# EAGLE design Dual linear VCA chip (EAGLE 6.4)
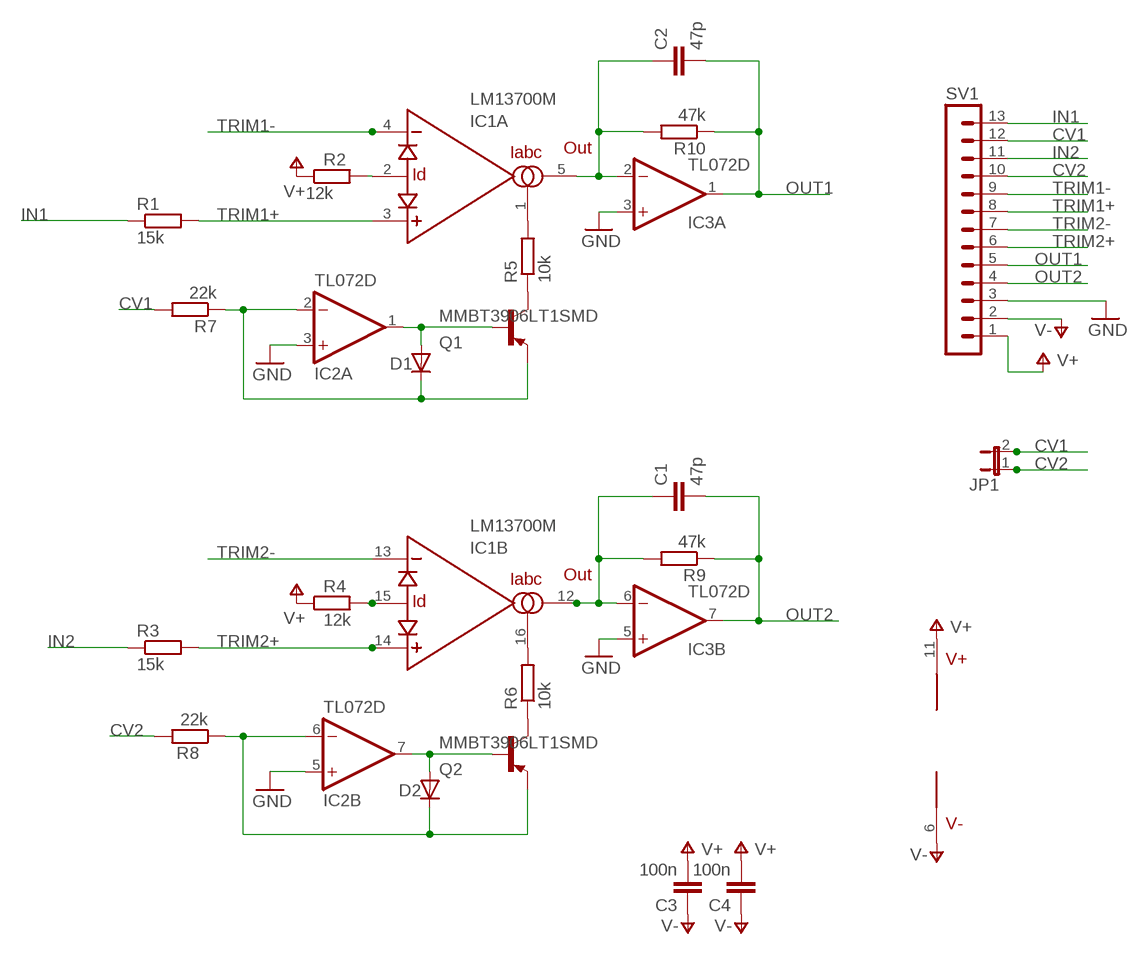
[diagram p0: schematic, sheet 1]

## Parts
C1  47p  C-EUC0805  [C0805]
C2  47p  C-EUC0805  [C0805]
C3  100n  C-EUC0805  [C0805]
C4  100n  C-EUC0805  [C0805]
D1  DIODE-SOD80C  [SOD80C]
D2  DIODE-SOD80C  [SOD80C]
IC1  LM13700M  [SO16]
IC2  TL072D  [SO08]
IC3  TL072D  [SO08]
JP1  JP1E  [JP1]
Q1  MMBT3906LT1SMD  [SOT23-BEC]
Q2  MMBT3906LT1SMD  [SOT23-BEC]
R1  15k  R-EU_R0805  [R0805]
R2  12k  R-EU_R0805  [R0805]
R3  15k  R-EU_R0805  [R0805]
R4  12k  R-EU_R0805  [R0805]
R5  10k  R-EU_R0805  [R0805]
R6  10k  R-EU_R0805  [R0805]
R7  22k  R-EU_R0805  [R0805]
R8  22k  R-EU_R0805  [R0805]
R9  47k  R-EU_R0805  [R0805]
R10  47k  R-EU_R0805  [R0805]
SV1  MA13-1  [MA13-1]

## Nets
CV1: JP1.2 R7.2 SV1.12
CV2: JP1.1 R8.2 SV1.10
GND: IC2.3(A:+IN) IC2.5(B:+IN) IC3.3(A:+IN) IC3.5(B:+IN) SV1.3
IN1: R1.1 SV1.13
IN2: R3.1 SV1.11
N$1: Q1.C R5.1
N$2: Q2.C R6.1
N$3: D1.C IC2.2(A:-IN) Q1.E R7.1
N$4: IC1.1(A:IABC) R5.2
N$6: IC1.2(A:ID) R2.2
N$8: D2.A IC2.7(B:OUT) Q2.B
N$9: C2.1 IC1.5(A:OUT) IC3.2(A:-IN) R10.2
N$10: D1.A IC2.1(A:OUT) Q1.B
N$11: D2.C IC2.6(B:-IN) Q2.E R8.1
N$14: IC1.16(B:IABC) R6.2
N$17: IC1.15(B:ID) R4.2
N$21: C1.1 IC1.12(B:OUT) IC3.6(B:-IN) R9.2
OUT1: C2.2 IC3.1(A:OUT) R10.1 SV1.4
OUT2: C1.2 IC3.7(B:OUT) R9.1 SV1.5
TRIM1+: IC1.3(A:+IN) R1.2 SV1.8
TRIM1-: IC1.4(A:-IN) SV1.9
TRIM2+: IC1.14(B:+IN) R3.2 SV1.6
TRIM2-: IC1.13(B:-IN) SV1.7
V+: C3.2 C4.2 IC1.11(V+) R2.1 R4.1 SV1.1
V-: C3.1 C4.1 IC1.6(V-) SV1.2
Unconnected: IC1.7(IN) IC1.8(OUT) IC1.9(OUT) IC1.10(IN)

## Power pins joined to a net without a drawn wire
V+: IC2.8(P:V+) IC3.8(P:V+)
V-: IC2.4(P:V-) IC3.4(P:V-)

## Library data of the parts
C1-C4 = resistor:C-EU: CAPACITOR, European symbol
D1 D2 = diode:DIODE-: DIODE
IC1 = synthdiy:LM13700: National Dual OTA with buffers.
IC2 IC3 = linear:TL072: OP AMP
JP1 = jumper:JP1E: JUMPER
Q1 Q2 = transistor-pnp:MMBT3906*: PNP Transistror
R1-R10 = resistor:R-EU_: RESISTOR, European symbol
SV1 = con-lstb:MA13-1: PIN HEADER; OC_FARNELL: unknown; OC_NEWARK: unknown

## Board
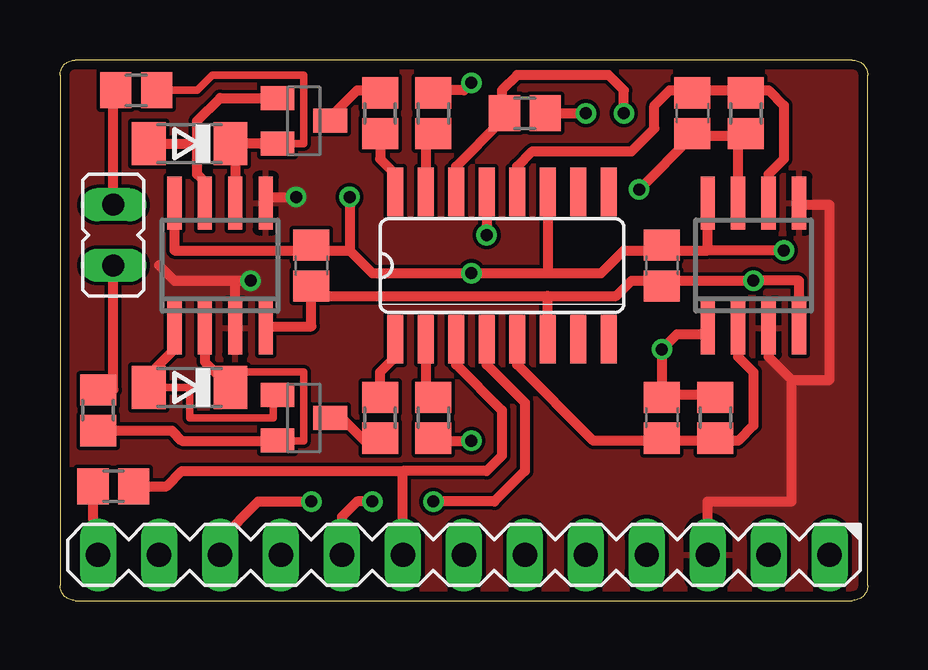
[diagram p1: board, top side]
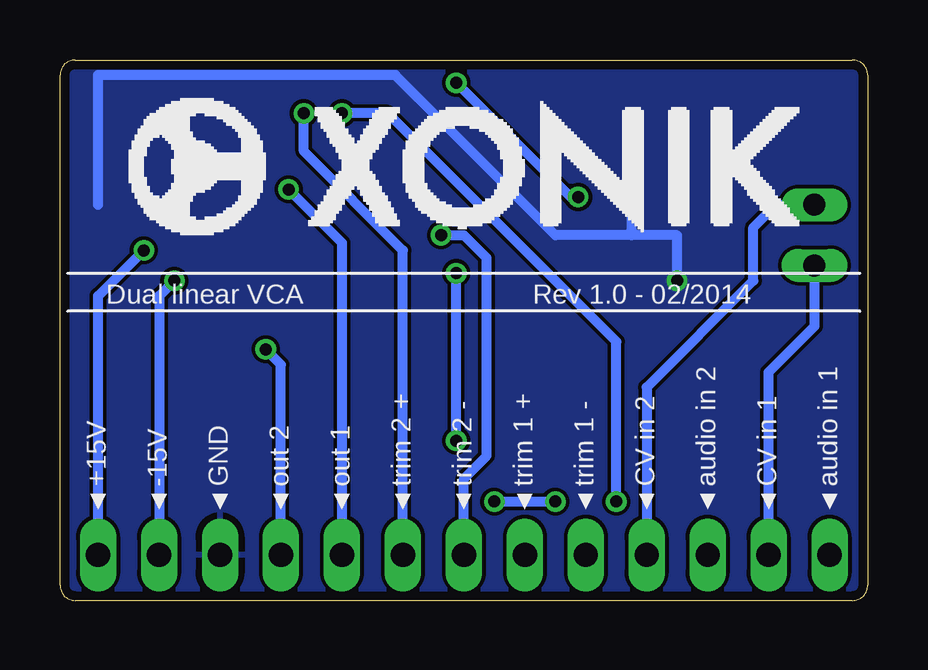
[diagram p2: board, bottom side, seen from below]

Size 33.66 x 22.54 mm. Coordinates in mm from the lower left corner, seen from the top.
Outline: 0.64,0 33.02,0 arc90 33.66,0.64 33.66,21.91 arc90 33.02,22.54 0.64,22.54 arc90 0,21.91 0,0.64 arc90 0.64,0
Copper layers (1*16): Top 0.0356mm / dielectric 1.5011mm / Bottom 0.0356mm
Design rules "LaenPCBOrder": minimum track width 6mil, minimum drill 13mil, track to track 6mil, track to pad 6mil, pad to pad 6mil, via to via 6mil, smd to smd 6mil, copper to edge 15mil, drill to drill 6mil, minimum pad ring 7mil, minimum via ring 7mil, stop-mask expansion 3mil, vias tented up to drill 0mil, thermal gap 10mil

### Footprints (pad centres in the part's own frame; a part is rotated, then mirrored left to right if it is on the bottom)
C0805 = smd 1.3 x 1.5: 1 -0.85,0; 2 0.85,0
SOD80C = smd 1.4 x 1.8: A 1.7,0; C -1.7,0
SO16 = smd 0.66 x 2.032: 1 -4.445,-3.073; 2 -3.175,-3.073; 3 -1.905,-3.073; 4 -0.635,-3.073; 5 0.635,-3.073; 6 1.905,-3.073; 7 3.175,-3.073; 8 4.445,-3.073; 9 4.445,3.073; 10 3.175,3.073; 11 1.905,3.073; 12 0.635,3.073; 13 -0.635,3.073; 14 -1.905,3.073; 15 -3.175,3.073; 16 -4.445,3.073
SO08 = smd 0.6 x 2.2: 1 -1.905,-2.6; 2 -0.635,-2.6; 3 0.635,-2.6; 4 1.905,-2.6; 5 1.905,2.6; 6 0.635,2.6; 7 -0.635,2.6; 8 -1.905,2.6
JP1 = drill 0.914 long: 1 0,-1.27; 2 0,1.27
SOT23-BEC = smd 1 x 1.4: B -0.95,-1.1; C 0,1.1; E 0.95,-1.1
R0805 = smd 1.3 x 1.5: 1 -0.85,0; 2 0.85,0
MA13-1 = drill 1.016 long: 1 -15.24,0; 2 -12.7,0; 3 -10.16,0; 4 -7.62,0; 5 -5.08,0; 6 -2.54,0; 7 0,0; 8 2.54,0; 9 5.08,0; 10 7.62,0; 11 10.16,0; 12 12.7,0; 13 15.24,0

### Placement (x,y rotation side)
C1  26.35,20.32 270 top
C2  25.08,7.62 90 top
C3  10.48,13.97 90 top
C4  25.08,13.97 90 top
D1  5.4,8.89 180 top
D2  5.4,19.05 180 top
IC1  18.41,13.97 0 top
IC2  6.67,13.97 0 top
IC3  28.89,13.97 0 top
JP1  2.22,15.24 180 top
Q1  10.16,7.62 270 top
Q2  10.16,20 270 top
R1  2.22,4.76 0 top
R2  15.56,7.62 90 top
R3  19.37,20.32 180 top
R4  15.56,20.32 270 top
R5  13.34,7.62 90 top
R6  13.34,20.32 270 top
R7  1.59,7.94 90 top
R8  3.17,21.27 180 top
R9  28.57,20.32 90 top
R10  27.3,7.62 270 top
SV1  16.83,1.91 180 top

### Tracks (layer width: path | path; a pad name or v marks a point on that pad's centre or on a via)
CV1
  Top 0.406: R7.2 2.22,8.79 JP1.2
  Bottom 0.406: SV1.12 4.13,9.53 2.22,11.43 JP1.2
CV2
  Top 0.406: 2.22,21.59 R8.2 2.22,21.17 JP1.1
  Bottom 0.406: SV1.10 9.21,8.89 4.76,13.34 4.76,15.56 3.81,16.51 JP1.1
GND  (via drill 0.5)
  Top 0.406: IC3.3 29.53,10.16 30.48,9.21 | 30.48,9.21 32.07,9.21 32.07,16.51 30.8,16.51 IC3.5 30.86,16.51 | 4.13,13.97 4.76,13.34 7.3,13.34 | SV1.3 26.99,4.13 30.48,4.13 30.48,9.21 | IC2.5 8.57,16.83 v9.84,16.83 | IC2.3 7.3,13.34 | 7.3,13.34 v7.94,13.34
  Bottom 0.406: v7.94,13.34 7.94,15.24 9.84,15.24 | 9.84,15.24 v9.84,16.83 | 32.07,16.51 32.07,21.91 19.68,21.91 13.02,15.24 9.84,15.24
  pour Top: 0,22.54 33.66,22.54 33.66,0 0,0
  pour Bottom: 0,22.54 33.66,22.54 33.66,0 0,0
IN1
  Top 0.406: R1.1 1.37,3.39 1.59,2.86 SV1.13
IN2  (via drill 0.5)
  Top 0.406: SV1.11 6.67,2.54 8.26,4.13 v10.48,4.13 | R3.1 v21.91,20.32
  Bottom 0.406: v10.48,4.13 10.48,10.79 20,20.32 v21.91,20.32
N$1
  Top 0.406: Q1.C 11.75,7.62 12.7,6.67 13.23,6.67 R5.1
N$2
  Top 0.406: Q2.C 11.26,20.15 12.38,21.27 13.23,21.27 R6.1
N$3
  Top 0.305: D1.C 7.42,9 7.62,9.21 7.62,9.53 10.16,9.53 10.16,6.67 Q1.E
  Top 0.406: IC2.2 6.03,9.96 D1.C | R7.1 4.66,7.09 5.08,6.67 Q1.E
N$4
  Top 0.406: R5.2 13.34,9.53 13.97,10.16 IC1.1
N$6
  Top 0.406: IC1.2 15.24,8.79 R2.2
N$8
  Top 0.406: IC2.7 6.03,17.46 5.71,17.78 5.71,19.05 | 5.71,19.05 5.71,20 6.67,20.95 Q2.B | D2.A 5.71,19.05
N$9
  Top 0.406: IC1.5 19.05,9.84 22.23,6.67 24.77,6.67 24.87,6.77 24.87,6.99 C2.1 25.18,6.67 27.3,6.67 R10.2 27.41,6.67 28.26,6.67 28.89,7.3 28.89,9.53 28.26,10.16 IC3.2
N$10
  Top 0.305: Q1.B 9.06,8.43 8.89,8.26 8.89,7.62 5.4,7.62 5.4,8.89 D1.A
  Top 0.406: D1.A 4.01,9.73 4.76,10.48 IC2.1
N$11
  Top 0.305: R8.1 5.71,21.27 6.35,21.91 10.16,21.91 10.16,19.05 Q2.E
  Top 0.406: IC2.6 7.3,18.3 D2.C 8.37,19.05 Q2.E
N$14
  Top 0.406: R6.2 13.34,18.41 13.97,17.78 IC1.16
N$17
  Top 0.406: R4.2 15.34,19.47 15.24,19.37 IC1.15
N$21
  Top 0.406: IC1.12 19.05,18.1 19.68,18.73 23.81,18.73 24.77,19.68 24.77,20.64 25.4,21.27 26.35,21.27 | 26.35,21.27 26.14,20.95 C1.1 26.35,21.27 | 26.35,21.27 28.47,21.27 R9.2 28.57,21.27 29.53,21.27 30.16,20.64 30.16,18.41 29.53,17.78 IC3.6
OUT1  (via drill 0.5)
  Top 0.406: IC3.1 26.73,11.11 25.72,11.11 v25.08,10.48 C2.2 25.18,8.57 27.3,8.57 R10.1
  Bottom 0.406: SV1.4 24.45,9.84 v25.08,10.48
OUT2  (via drill 0.5)
  Top 0.406: IC3.7 28.26,19.05 28.36,19.15 28.89,19.15 R9.1 28.79,19.47 28.89,19.37 26.45,19.37 C1.2 26.35,19.37 v24.13,17.14
  Bottom 0.406: v24.13,17.14 21.91,14.92 SV1.5
TRIM1+
  Top 0.406: IC1.3 16.51,9.84 18.41,7.94 18.41,6.03 17.78,5.4 14.29,5.4 | SV1.8 14.29,5.4 | R1.2 4.45,4.76 5.08,5.4 14.29,5.4
TRIM1-  (via drill 0.5)
  Top 0.406: IC1.4 17.78,9.84 19.37,8.26 19.37,5.4 18.1,4.13 v15.56,4.13 | v13.02,4.13 12.38,4.13 11.75,3.49 SV1.9
  Bottom 0.406: v15.56,4.13 v13.02,4.13
TRIM2+  (via drill 0.5)
  Top 0.406: IC1.14 16.51,18.1 18.41,20 18.41,20.42 | v23.5,20.32 23.5,21.27 22.86,21.91 19.05,21.91 18.41,21.27 18.41,20.85 | 18.41,20.85 18.41,20.42 | 18.41,20.42 R3.2 18.41,20.85
  Bottom 0.406: SV1.6 19.37,14.61 23.5,18.73 v23.5,20.32
TRIM2-  (via drill 0.5)
  Top 0.406: IC1.13 v17.78,15.24
  Bottom 0.406: SV1.7 16.83,5.08 15.88,6.03 15.88,14.29 16.83,15.24 v17.78,15.24
V+  (via drill 0.5)
  Top 0.406: IC2.8 4.76,14.61 10.48,14.61 | 20.32,13.65 22.54,13.65 23.5,14.61 25.08,14.61 | 25.08,14.61 26.99,14.61 | 26.99,14.61 IC3.8 | IC1.11 20.32,13.65 | C4.2 25.08,14.61 | C3.2 10.48,14.61 | 10.48,14.61 12.06,14.61 | v12.06,16.83 12.06,14.61 | 12.06,14.61 13.02,13.65 v17.14,13.65 20.32,13.65 | v30.16,14.61 26.99,14.61 | R2.1 15.77,6.77 15.88,6.67 v17.14,6.67 | v17.14,21.59 16.83,21.27 15.66,21.27 R4.1
  Bottom 0.406: v30.16,14.61 32.07,12.7 SV1.1 | v17.14,6.67 v17.14,13.65 | v17.14,21.59 12.38,16.83 v12.06,16.83
V-  (via drill 0.5)
  Top 0.406: IC2.4 8.57,11.43 10.48,11.43 C3.1 | 10.48,13.34 C3.1 | 20.32,12.7 10.48,12.7 C3.1 | 20.32,12.7 23.18,12.7 23.81,13.34 25.08,13.34 | 25.08,13.34 v28.89,13.34 30.8,13.34 IC3.4 | IC1.6 20.32,12.7 | C4.1 25.08,13.34
  Bottom 0.406: v28.89,13.34 29.53,12.7 SV1.2

### Text on the board
bNames: Rev 1.0 - 02/2014 | Dual linear VCA | audio in 1 | CV in 1 | audio in 2 | CV in 2 | trim 1 - | trim 1 + | trim 2 - | trim 2 + | out 1 | out 2 | GND | -15V | +15V